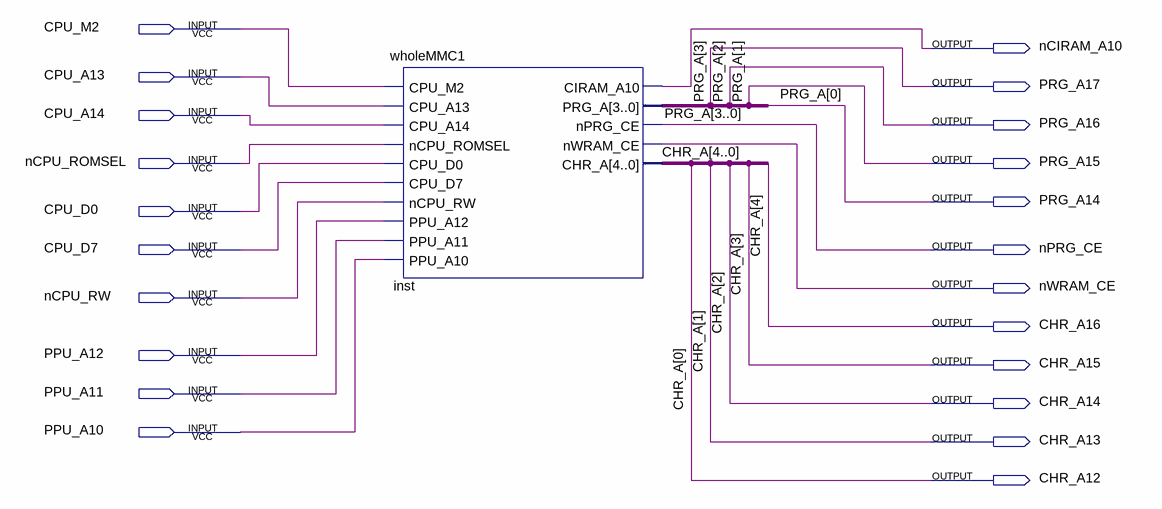
[diagram p0: schematic sheet]
// Quartus schematic MMC1.bdf as structural Verilog: 1 symbols, 22 pins
module MMC1 (
  input  CPU_M2,
  input  CPU_A13,
  input  CPU_A14,
  input  nCPU_ROMSEL,
  input  CPU_D0,
  input  CPU_D7,
  input  nCPU_RW,
  input  PPU_A12,
  input  PPU_A11,
  input  PPU_A10,
  output nCIRAM_A10,
  output PRG_A17,
  output PRG_A16,
  output PRG_A15,
  output PRG_A14,
  output nPRG_CE,
  output nWRAM_CE,
  output CHR_A16,
  output CHR_A15,
  output CHR_A14,
  output CHR_A13,
  output CHR_A12
);

  wholeMMC1 inst (
    .CPU_M2(CPU_M2), .CPU_A13(CPU_A13), .CPU_A14(CPU_A14), .nCPU_ROMSEL(nCPU_ROMSEL), .CPU_D0(CPU_D0),
    .CPU_D7(CPU_D7), .nCPU_RW(nCPU_RW), .PPU_A12(PPU_A12), .PPU_A11(PPU_A11), .PPU_A10(PPU_A10),
    .CIRAM_A10(nCIRAM_A10), .PRG_A({PRG_A17, PRG_A16, PRG_A15, PRG_A14}), .nPRG_CE(nPRG_CE),
    .nWRAM_CE(nWRAM_CE), .CHR_A({CHR_A16, CHR_A15, CHR_A14, CHR_A13, CHR_A12}));

  // Other names for the same wires on the sheet: CHR_A[4:0] = {CHR_A16, CHR_A15, CHR_A14, CHR_A13, CHR_A12};
  //   PRG_A[3:0] = {PRG_A17, PRG_A16, PRG_A15, PRG_A14}
endmodule
